# Altium schematic sheet LCD.SchDoc
size A4; DocumentNumber: 7; SheetNumber: 8; SheetTotal: 11
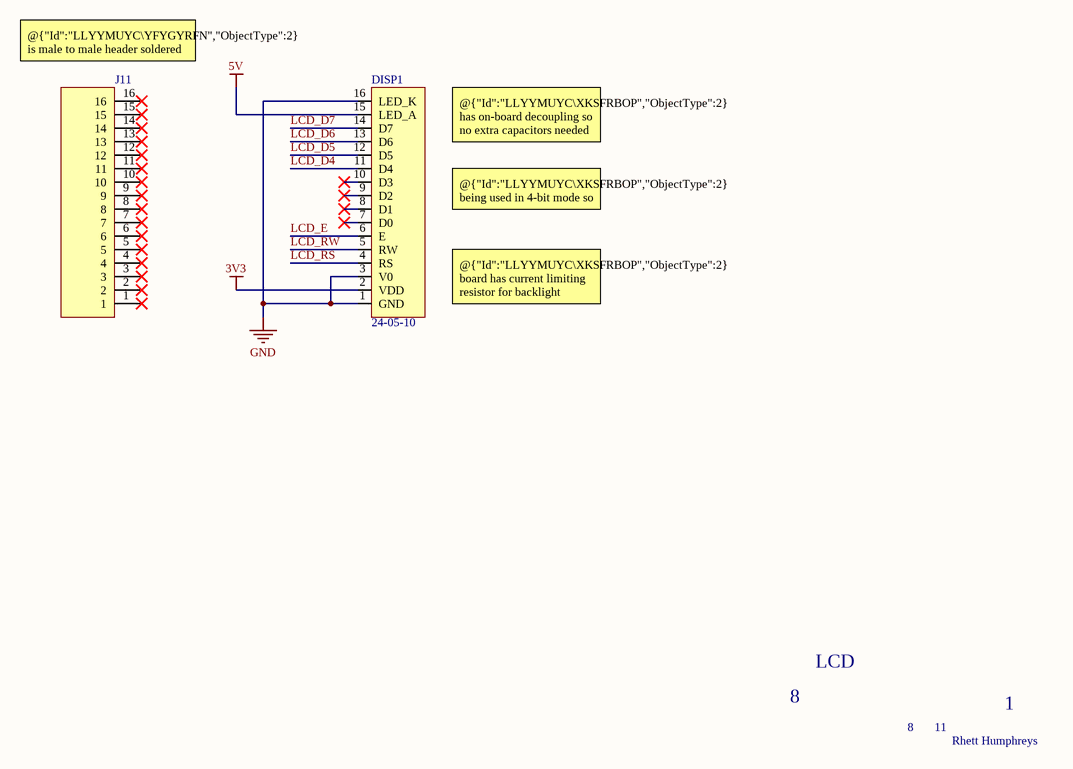
[diagram p0: LCD.SchDoc]

## Parts
DISP1  24-05-10  [ERM2004 40x2 LCD]
J11  Header, 16pos 2.54mm  (value not drawn)

## Nets
3V3: DISP1.2(VDD)
5V: DISP1.15(LED_A)
GND: DISP1.1(GND) DISP1.3(V0) DISP1.16(LED_K)
LCD_D4: DISP1.11(D4)
LCD_D5: DISP1.12(D5)
LCD_D6: DISP1.13(D6)
LCD_D7: DISP1.14(D7)
LCD_E: DISP1.6(E)
LCD_RS: DISP1.4(RS)
LCD_RW: DISP1.5(RW)

Not connected (* = marked no-connect by the designer): DISP1 7(D0)* 8(D1)* 9(D2)* 10(D3)*; J11 1* 2* 3* 4* 5* 6* 7* 8* 9* 10* 11* 12* 13* 14* 15* 16*

## Notes on the sheet
- (near J11) @{"Id":"LLYYMUYC\YFYGYRFN","ObjectType":2} is male to male header soldered to @{"Id":"LLYYMUYC\XKSFRBOP","ObjectType":2} PCB.
- @{"Id":"LLYYMUYC\XKSFRBOP","ObjectType":2} has on-board decoupling so no extra capacitors needed
- @{"Id":"LLYYMUYC\XKSFRBOP","ObjectType":2} being used in 4-bit mode so D0 to D3 are NC
- @{"Id":"LLYYMUYC\XKSFRBOP","ObjectType":2} board has current limiting resistor for backlight
- LCD
- 8
- 11
- 1
- Rhett Humphreys

## Library data of the parts
DISP1 = ERM2004 40x2 LCD